# EAGLE design Hyttkontakt (EAGLE 9.4.2)
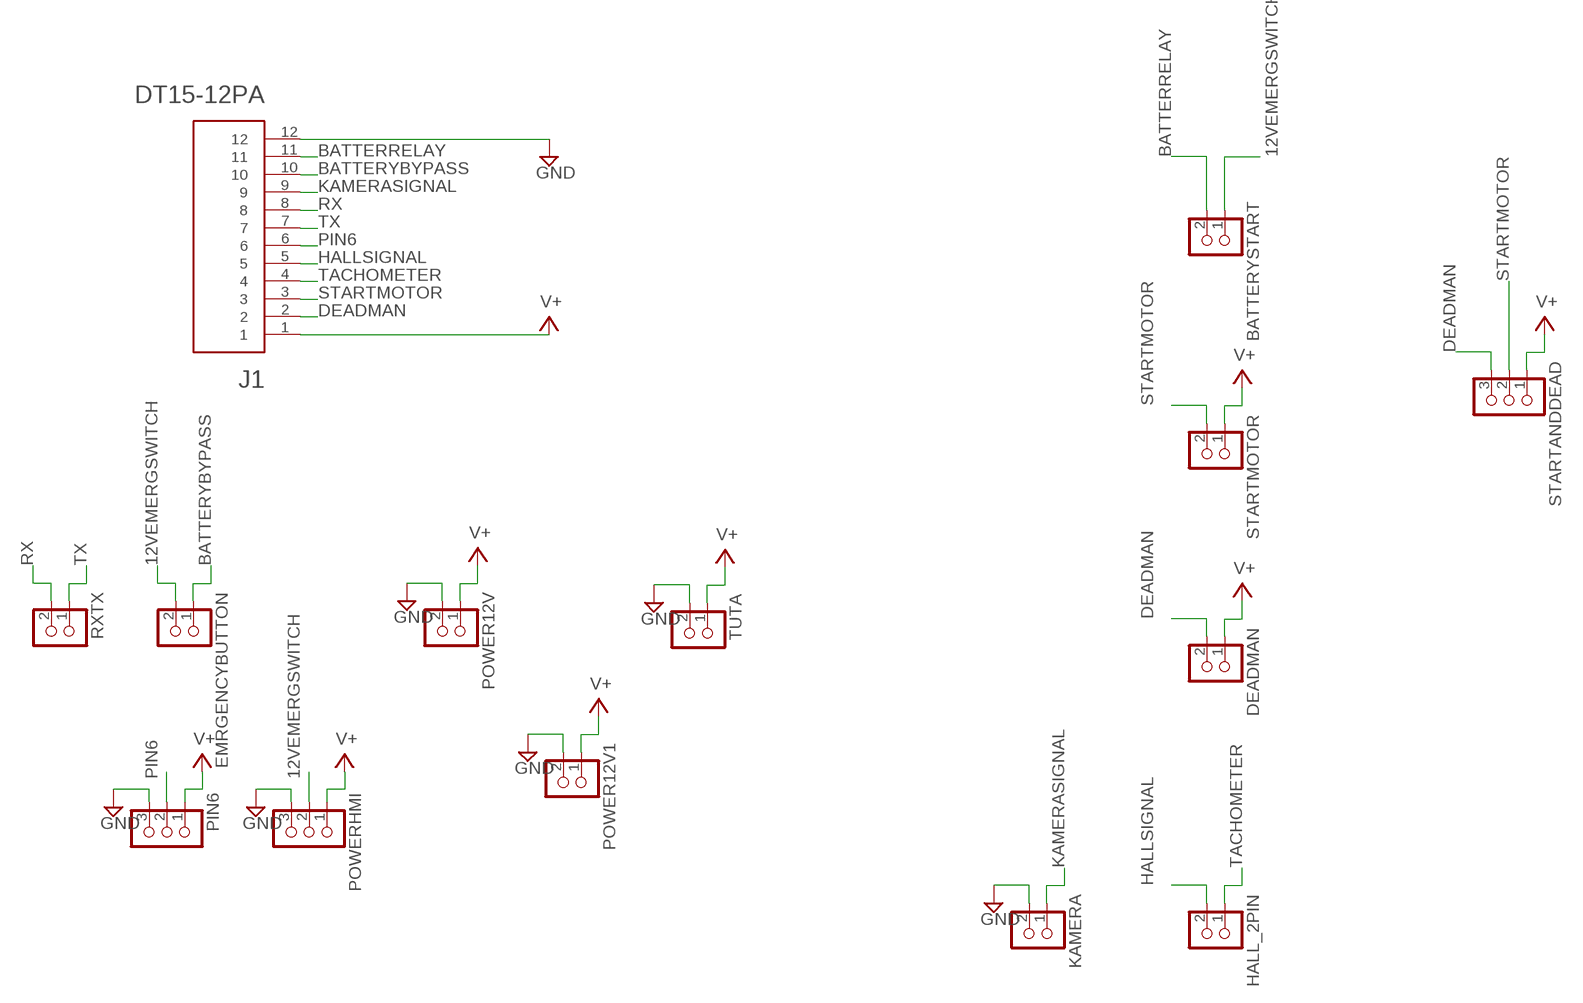
[diagram p0: schematic, sheet 1]

## Parts
BATTERYSTART  EH_B2B-EH  [B2B-EH]
DEADMAN  EH_B2B-EH  [B2B-EH]
EMRGENCYBUTTON  EH_B2B-EH  [B2B-EH]
HALL_2PIN  EH_B2B-EH  [B2B-EH]
J1  DT15-12PA  [TE_DT15-12PA]
KAMERA  EH_B2B-EH  [B2B-EH]
PIN6  EH_B3B-EH  [B3B-EH]
POWER12V  EH_B2B-EH  [B2B-EH]
POWER12V1  EH_B2B-EH  [B2B-EH]
POWERHMI  EH_B3B-EH  [B3B-EH]
RXTX  EH_B2B-EH  [B2B-EH]
STARTANDDEAD  EH_B3B-EH  [B3B-EH]
STARTMOTOR  EH_B2B-EH  [B2B-EH]
TUTA  EH_B2B-EH  [B2B-EH]

## Nets
12VEMERGSWITCH: BATTERYSTART.1 EMRGENCYBUTTON.2 POWERHMI.2
BATTERRELAY: BATTERYSTART.2 J1.11
BATTERYBYPASS: EMRGENCYBUTTON.1 J1.10
DEADMAN: DEADMAN.2 J1.2 STARTANDDEAD.3
GND: J1.12 KAMERA.2 PIN6.3 POWER12V1.2 POWER12V.2 POWERHMI.3 TUTA.2
HALLSIGNAL: HALL_2PIN.2 J1.5
KAMERASIGNAL: J1.9 KAMERA.1
PIN6: J1.6 PIN6.2
RX: J1.8 RXTX.2
STARTMOTOR: J1.3 STARTANDDEAD.2 STARTMOTOR.2
TACHOMETER: HALL_2PIN.1 J1.4
TX: J1.7 RXTX.1
V+: DEADMAN.1 J1.1 PIN6.1 POWER12V1.1 POWER12V.1 POWERHMI.1 STARTANDDEAD.1 STARTMOTOR.1 TUTA.1

## Library data of the parts
BATTERYSTART DEADMAN EMRGENCYBUTTON HALL_2PIN KAMERA POWER12V POWER12V1 RXTX STARTMOTOR TUTA = CASE-JST:EH_B2B-EH: JST EH Connector, through hole, 2 pin, top entry Description: JST EH connector with 2.5 mm pitch, through hole version, 2 pin, top entry. Links: Datasheet <http://www.jst-mfg.com/product/pdf/eng/eEH.pdf>
J1 = DT15-12PA:DT15-12PA: DEUTSCH Automotive; DT RECP ASM; AVAILABILITY: In stock; DESCRIPTION: DEUTSCH Automotive; DT RECP ASM; MF: TE Connectivity; MPN: DT15-12PA; PARTREV: C3; STANDARD: Manufacturer recommendation
PIN6 POWERHMI STARTANDDEAD = CASE-JST:EH_B3B-EH: JST EH Connector, through hole, 3 pin, top entry Description: JST EH connector with 2.5 mm pitch, through hole version, 3 pin, top entry. Links: Datasheet <http://www.jst-mfg.com/product/pdf/eng/eEH.pdf>

## Net classes
0 default: width 1.27 mm, drill 0.762 mm, clearance 0.381 mm

## Board
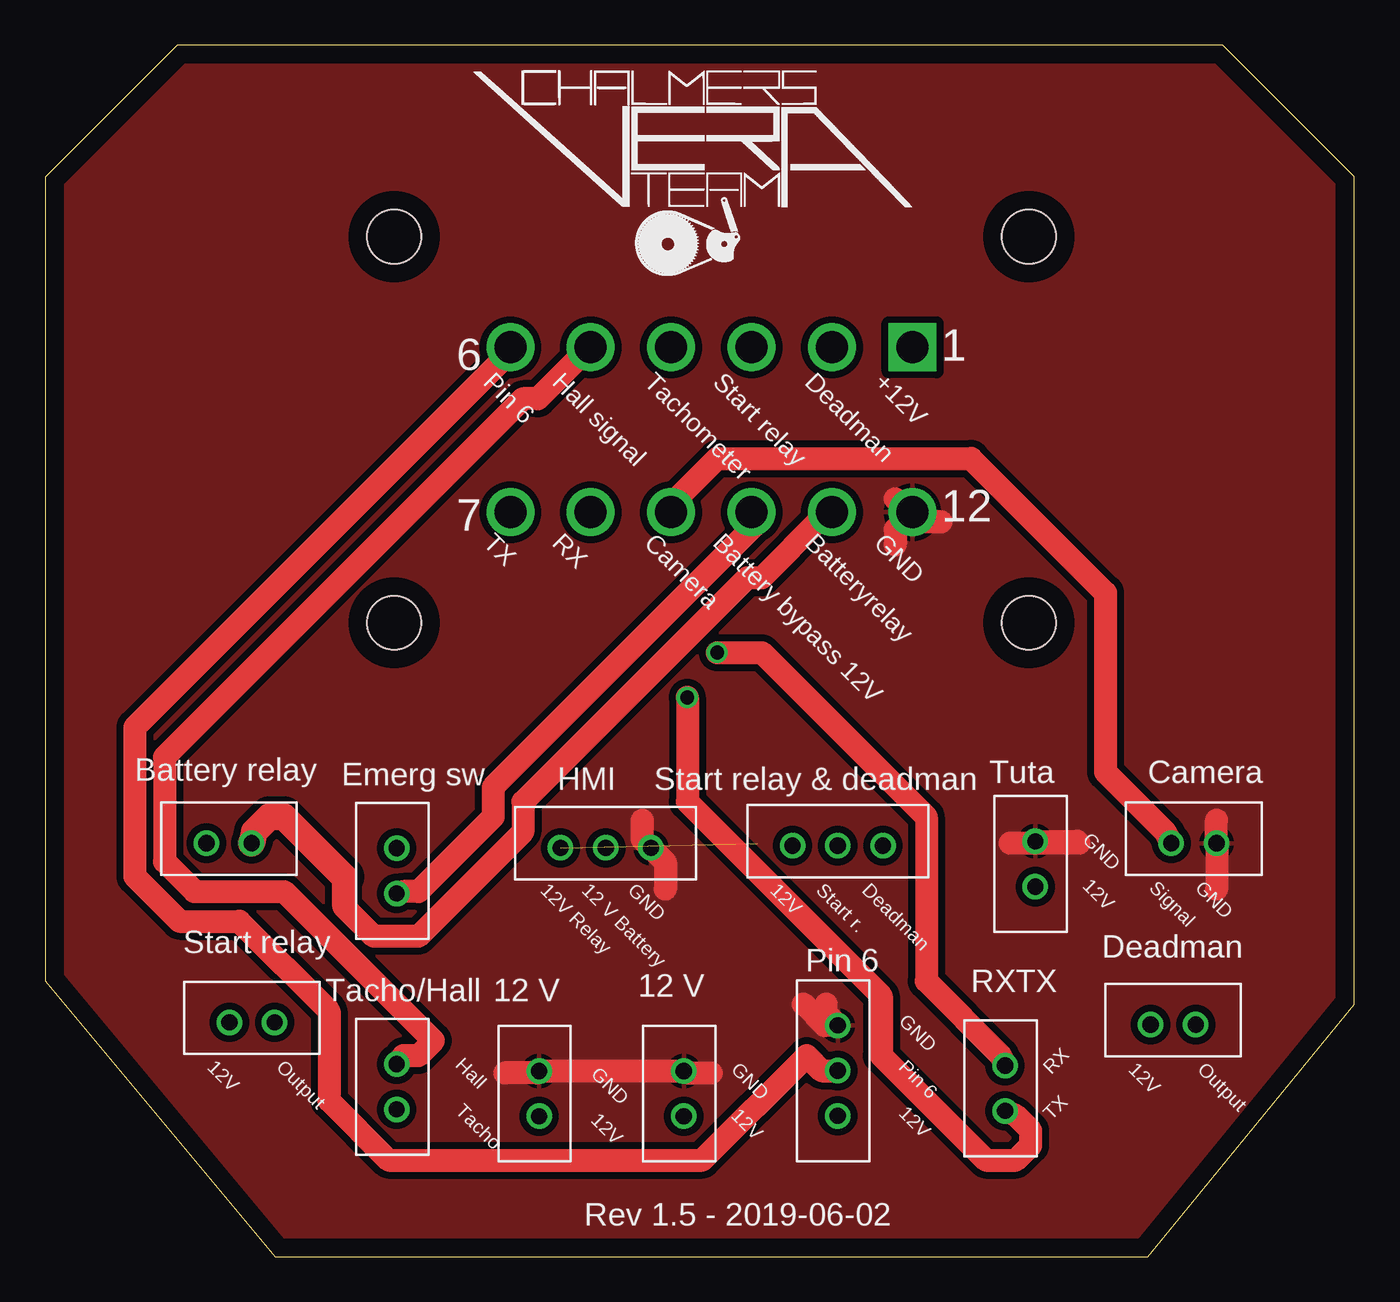
[diagram p1: board, top side]
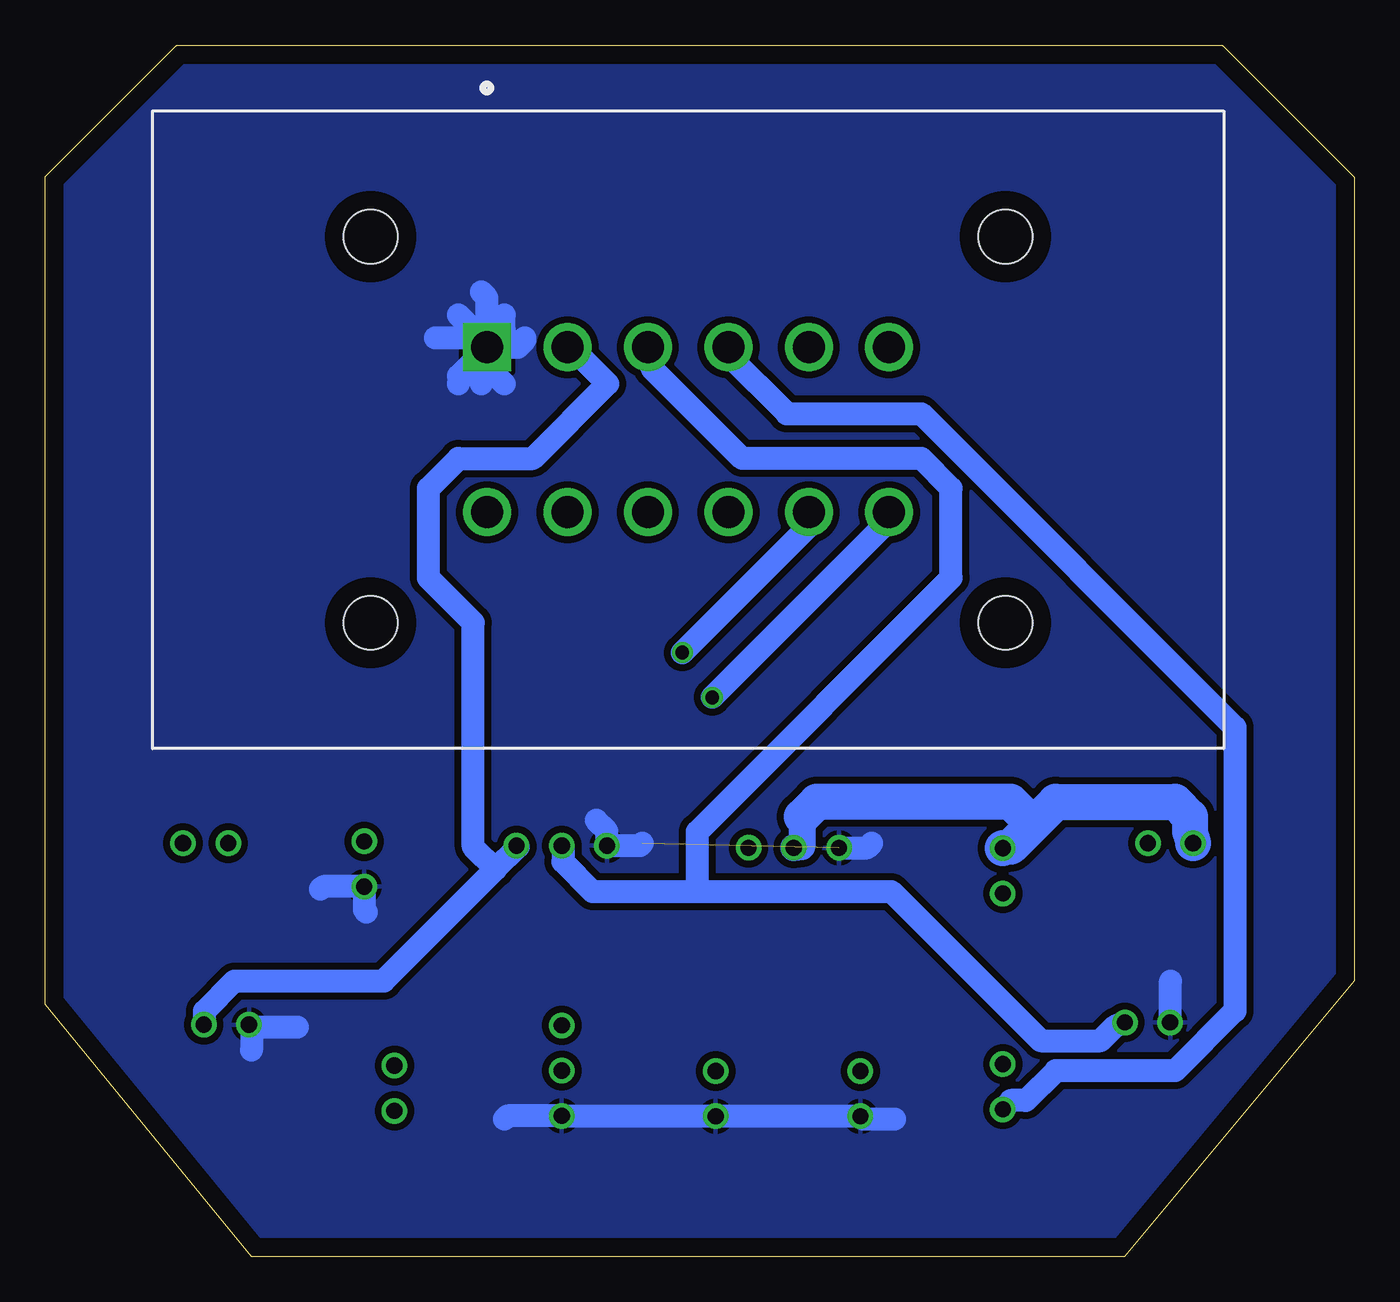
[diagram p2: board, bottom side, seen from below]

Size 72.37 x 66.98 mm. Coordinates in mm from the lower left corner, seen from the top.
Outline: 0,59.69 0,15.24 12.7,0 60.96,0 72.37,13.95 72.37,59.71 65.1,66.98 7.29,66.98 0,59.69
Copper layers (1*16): Top 0.035mm / dielectric 1.5mm / Bottom 0.035mm
Design rules "default *": minimum track width 10mil, minimum drill 0.35mm, track to track 6mil, track to pad 6mil, pad to pad 6mil, via to via 6mil, smd to smd 6mil, copper to edge 40mil, drill to drill 6mil, minimum pad ring 10mil, minimum via ring 8mil, stop-mask expansion 4mil, vias tented up to drill 0mil, thermal gap 10mil

### Footprints (pad centres in the part's own frame; a part is rotated, then mirrored left to right if it is on the bottom)
B2B-EH = drill 0.9: 1 -1.25,0; 2 1.25,0
TE_DT15-12PA = drill 1.77 square: 1 -4.56,-11.115 | drill 1.77: 2 -4.56,-6.67; 3 -4.56,-2.225; 4 -4.56,2.225; 5 -4.56,6.67; 6 -4.56,11.115; 7 4.56,11.115; 8 4.56,6.67; 9 4.56,2.225; 10 4.56,-2.225; 11 4.56,-6.67; 12 4.56,-11.115 | hole 2.99: -10.67,17.535; 10.67,17.535; 10.67,-17.545; -10.67,-17.545
B3B-EH = drill 0.9: 1 -2.5,0; 2 0,0; 3 2.5,0

### Placement (x,y rotation side)
BATTERYSTART  10.16,22.86 0 top
DEADMAN  62.36,12.83 0 top
EMRGENCYBUTTON  19.43,21.34 90 top
HALL_2PIN  19.43,9.4 90 top
J1  36.83,45.72 270 bottom
KAMERA  63.5,22.86 0 top
PIN6  43.81,10.29 90 top
POWER12V  35.31,9.02 90 top
POWER12V1  27.3,9.02 90 top
POWERHMI  30.99,22.61 0 top
RXTX  53.06,9.31 90 top
STARTANDDEAD  43.81,22.73 0 top
STARTMOTOR  11.43,12.95 0 top
TUTA  54.74,21.72 90 top

### Tracks (layer width: path | path; a pad name or v marks a point on that pad's centre or on a via)
12VEMERGSWITCH
  Bottom 1.5: 30.54,24.32 30.54,22.67 POWERHMI.2
  Bottom 2: 17.75,23.91 18.99,22.67 EMRGENCYBUTTON.2 | 17.75,23.91 16.51,25.15 9.91,25.15 9.08,24.32 9.08,23.49 BATTERYSTART.1 | 30.54,24.32 29.72,25.15 18.99,25.15 17.75,23.91
BATTERRELAY
  Top 1.27: 16.51,21.02 16.51,19.37 18.16,17.72 20.64,17.72 26.42,23.49 26.42,25.15 38.8,37.53 39.62,37.53 42.93,40.83 J1.11
  Top 1.5: 16.51,21.02 13.21,24.32 12.38,24.32 11.56,23.49 BATTERYSTART.2
BATTERYBYPASS
  Top 1.27: EMRGENCYBUTTON.1 19.81,20.19 20.64,20.19 24.77,24.32 24.77,25.97 39.62,40.83 J1.10
DEADMAN
  Bottom 1.27: 47.47,21.43 53.66,15.24 61.91,15.24 63.56,13.59 63.56,12.76 DEADMAN.2 | 47.47,21.43 46.23,22.67 STARTANDDEAD.3 | 47.47,21.43 48.7,22.67 48.7,35.05 51.18,37.53 51.18,42.48 49.53,44.13 45.4,44.13 41.27,48.26 42.93,49.91 J1.2
GND
  Top 1.27: 36.83,10.16 35.56,10.16 35.45,10.27 POWER12V1.2 27.2,10.16 25.4,10.16 | 34.29,20.32 34.29,21.8 POWERHMI.3 33.02,23.07 33.02,24.13 | TUTA.2 57.04,22.97 57.15,22.86 54.84,22.86 TUTA.2 | TUTA.2 54.63,22.86 53.34,22.86 | 64.77,20.32 64.77,22.84 KAMERA.2 64.75,24.11 64.77,24.13 | 41.91,13.97 43.09,12.79 PIN6.3 43.18,13.42 43.18,13.97 | J1.12 46.99,40.2 46.99,39.37 | J1.12 47.95,40.95 48.26,40.64 | J1.12 48.47,40.64 49.53,40.64 | J1.12 47.74,41.16 46.99,41.91
  pour Top: -4.5,71.43 88.94,71.43 89.75,70.62 78.9,-3.43 76.71,-5.63 -0.46,-5.63 -4.73,-1.35 -4.49,-1.11 -4.49,71.42
HALLSIGNAL
  Top 1.27: HALL_2PIN.2 19.81,11.11 20.64,11.11 21.46,11.94 13.21,20.19 8.26,20.19 6.6,21.84 6.6,27.62 26.42,47.44 27.24,47.44 29.72,49.91 J1.5
KAMERASIGNAL
  Top 1.27: KAMERA.1 61.91,23.49 58.61,26.8 58.61,36.7 51.18,44.13 37.15,44.13 34.67,41.66 J1.9
PIN6
  Top 1.27: PIN6.2 42.93,10.29 42.1,11.11 36.32,5.33 18.99,5.33 15.68,8.64 15.68,13.59 10.73,18.54 7.43,18.54 4.95,21.02 4.95,29.27 25.59,49.91 J1.6
RX  (via drill 0.76)
  Top 1.27: v37.15,33.4 39.62,33.4 48.7,24.32 48.7,15.24 52.83,11.11 RXTX.2
  Bottom 1.27: v37.15,33.4 29.72,40.83 J1.8
STARTMOTOR
  Bottom 1.27: 36.32,20.19 42.1,20.19 43.75,21.84 43.75,22.67 STARTANDDEAD.2 | 36.32,20.19 25.59,20.19 17.34,11.94 14.03,11.94 13.21,12.76 STARTMOTOR.2 | 36.32,20.19 36.32,23.49 22.29,37.53 22.29,42.48 23.94,44.13 33.85,44.13 38.8,49.08 38.8,49.91 J1.3
TACHOMETER
  Bottom 1.27: HALL_2PIN.1 18.99,8.64 18.16,8.64 16.51,10.29 9.91,10.29 6.6,13.59 6.6,29.27 23.94,46.61 31.37,46.61 34.67,49.91 J1.4
TX  (via drill 0.76)
  Top 1.27: v35.5,30.92 35.5,25.15 46.23,14.41 46.23,11.11 52.01,5.33 53.66,5.33 54.48,6.16 54.48,6.98 53.66,7.81 RXTX.1
  Bottom 1.27: v35.5,30.92 25.59,40.83 J1.7
V+  (1 unrouted)
  Bottom 1.27: J1.1 47.95,53.03 48.26,53.34 | J1.1 48.47,50.8 50.8,50.8 | J1.1 48.26,49.97 48.26,48.26 | J1.1 46.24,50.28 45.84,50.68 45.84,50.8 | J1.1 46.99,51.23 46.99,52.07 | J1.1 47.95,50.48 49.53,52.07 | J1.1 49.53,48.69 49.53,48.26 | J1.1 47.95,49.22 46.99,48.26 | 41.91,24.13 41.31,23.53 STARTANDDEAD.1 39.5,22.73 39.37,22.86 | POWERHMI.1 26.92,22.61 26.67,22.86 | STARTMOTOR.1 10.16,12.97 10.16,15.24 | 46.99,7.62 46.82,7.79 PIN6.1 43.8,7.77 POWER12V1.1 27.16,7.62 25.4,7.62 | 58.42,12.7 60.98,12.7 DEADMAN.1 60.96,12.68 60.96,11.43 | 57.15,20.32 57,20.47 TUTA.1 54.74,19.18 54.61,19.05
  pour Bottom: -4.57,71.3 88.99,71.3 89.13,71.45 89.13,6.91 76.66,-5.57 -0.56,-5.57 -0.56,67.27 -4.57,71.28

### Text on the board
tNames: 6 | 1 | Pin 6 | Hall signal | Tachometer | Start relay | Deadman | +12V | 7 | 12 | TX | RX | Camera | Battery bypass 12V | Batteryrelay | GND | Battery relay | Emerg sw | HMI | Start relay & deadman | Tuta | Camera | GND | 12V Relay | 12 V Battery | GND | 12V | Start r. | Deadman | 12V | Signal | GND | Start relay | Pin 6 | Deadman | Tacho/Hall | 12 V | 12 V | RXTX | GND | 12V | Output | Hall | GND | GND | Pin 6 | RX | 12V | Output | Tacho | 12V | 12V | 12V | TX | Rev 1.5 - 2019-06-02